# Altium project 20240807_MMIC_PCB_Carrier.PrjPcb
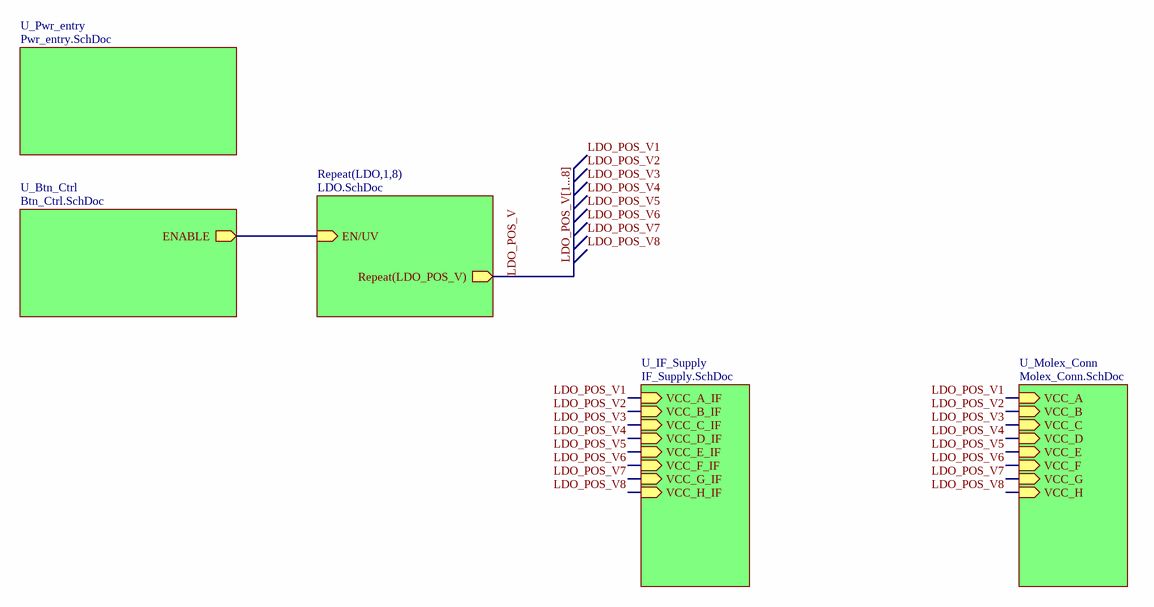
[diagram p0: MAIN_SCH.SchDoc]
6 sheets, 155 parts. Net scope: hierarchical (ports join the sheet entries above them; power ports are global).
Board file: 20240807_Carrier.PcbDoc
Sheets:
  MAIN_SCH.SchDoc
    LDO1 = LDO.SchDoc
    LDO2 = LDO.SchDoc
    LDO3 = LDO.SchDoc
    LDO4 = LDO.SchDoc
    LDO5 = LDO.SchDoc
    LDO6 = LDO.SchDoc
    LDO7 = LDO.SchDoc
    LDO8 = LDO.SchDoc
    U_Btn_Ctrl = Btn_Ctrl.SchDoc
    U_Pwr_entry = Pwr_entry.SchDoc
    U_IF_Supply = IF_Supply.SchDoc
    U_Molex_Conn = Molex_Conn.SchDoc

## Sheet MAIN_SCH.SchDoc
size A4; SheetNumber: 1; SheetTotal: 6

### Sub-sheets
Repeat(LDO,1,8) = LDO.SchDoc: EN/UV (in), Repeat(LDO_POS_V) (out)
U_Btn_Ctrl = Btn_Ctrl.SchDoc: ENABLE (out)
U_IF_Supply = IF_Supply.SchDoc: VCC_A_IF (in), VCC_B_IF (in), VCC_C_IF (in), VCC_D_IF (in), VCC_E_IF (in), VCC_F_IF (in), VCC_G_IF (in), VCC_H_IF (in)
U_Molex_Conn = Molex_Conn.SchDoc: VCC_A (in), VCC_B (in), VCC_C (in), VCC_D (in), VCC_E (in), VCC_F (in), VCC_G (in), VCC_H (in)
U_Pwr_entry = Pwr_entry.SchDoc: no entries

### Nets
LDO_POS_V: sheet Repeat(LDO,1,8)/Repeat(LDO_POS_V)
LDO_POS_V1: sheet U_IF_Supply/VCC_A_IF, sheet U_Molex_Conn/VCC_A  [project net J1-1]
LDO_POS_V2: sheet U_IF_Supply/VCC_B_IF, sheet U_Molex_Conn/VCC_B  [project net J1-3]
LDO_POS_V3: sheet U_IF_Supply/VCC_C_IF, sheet U_Molex_Conn/VCC_C  [project net J1-5]
LDO_POS_V4: sheet U_IF_Supply/VCC_D_IF, sheet U_Molex_Conn/VCC_D  [project net J1-7]
LDO_POS_V5: sheet U_IF_Supply/VCC_E_IF, sheet U_Molex_Conn/VCC_E  [project net J2-1]
LDO_POS_V6: sheet U_IF_Supply/VCC_F_IF, sheet U_Molex_Conn/VCC_F  [project net J2-3]
LDO_POS_V7: sheet U_IF_Supply/VCC_G_IF, sheet U_Molex_Conn/VCC_G  [project net J2-5]
LDO_POS_V8: sheet U_IF_Supply/VCC_H_IF, sheet U_Molex_Conn/VCC_H  [project net J2-7]
NetIC1_LDO1_4: sheet Repeat(LDO,1,8)/EN/UV, sheet U_Btn_Ctrl/ENABLE

### Buses and harness runs
bus LDO_POS_V[1...8]

### Notes on the sheet
- Labels drawn without touching a wire or pin: LDO_POS_V1, LDO_POS_V2, LDO_POS_V3, LDO_POS_V4, LDO_POS_V5, LDO_POS_V6, LDO_POS_V7, LDO_POS_V8
- Title
- Size:
- Date:
- A4
- Designer:
- Time:
- Sheet
- Revision:
- of
- University of Stuttgart
- ILH
- Pfaffenwaldring 47
- 70569 Stuttgart
- Germany
- File:

## Sheet LDO.SchDoc
size A4; SheetNumber: 3; SheetTotal: 6
Used 8 times, as channels LDO1, LDO2, LDO3, LDO4, LDO5, LDO6, LDO7, LDO8. Parts and nets are listed once, with the designators drawn on the sheet.
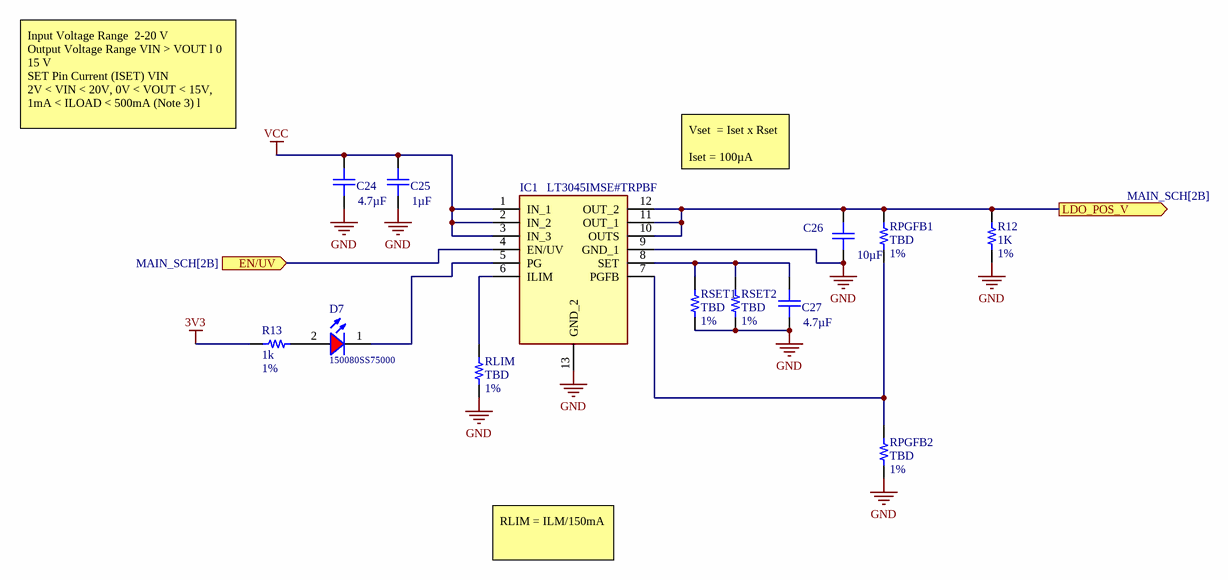
[diagram p1: LDO.SchDoc]

### Parts
C24  value 4.7µF  [FP-CL10-IPC_B]  (hidden comment: Capacitor)
C25  value 1µF  [FP-CL10-IPC_B]  (hidden comment: Capacitor)
C26  value 10µF  [FP-CL10-IPC_B]  (hidden comment: Capacitor)
C27  value 4.7µF  [FP-CL10-IPC_B]  (hidden comment: Capacitor)
D7  150080SS75000  [WL-SMCW_0805]
IC1  LT3045IMSE#TRPBF  [SOP65P490X110-13N]
R12  value 1K  Tolerance: 1%  [RESC1608X06N 0603 Medium Density]  (hidden comment: RC0603FR-071KL)
R13  value 1k  Tolerance: 1%  [RESC1608X06N 0603 Medium Density]  (hidden comment: RC0603FR-071KL)
RLIM  value TBD  Tolerance: 1%  [RESC1608X06N 0603 Medium Density]  (hidden comment: RC0603FR-071KL)
RPGFB1  value TBD  Tolerance: 1%  [RESC1608X06N 0603 Medium Density]  (hidden comment: RC0603FR-071KL)
RPGFB2  value TBD  Tolerance: 1%  [RESC1608X06N 0603 Medium Density]  (hidden comment: RC0603FR-071KL)
RSET1  value TBD  Tolerance: 1%  [RESC1608X06N 0603 Medium Density]  (hidden comment: RC0603FR-071KL)
RSET2  value TBD  Tolerance: 1%  [RESC1608X06N 0603 Medium Density]  (hidden comment: RC0603FR-071KL)

### Ports
EN/UV (in, see MAIN_SCH[2B]), LDO_POS_V (out, see MAIN_SCH[2B])

### Nets
3V3: R13.2
GND: C24.1 C25.1 C26.1 C27.1 IC1.9(GND_1) IC1.13(GND_2) R12.2 RLIM.2 RPGFB2.2 RSET1.2 RSET2.2
VCC: C24.2 C25.2 IC1.1(IN_1) IC1.2(IN_2) IC1.3(IN_3)
EN/UV: IC1.4(EN/UV) ; port EN/UV
LDO_POS_V: C26.2 IC1.10(OUTS) IC1.11(OUT_1) IC1.12(OUT_2) R12.1 RPGFB1.1 ; port LDO_POS_V
NetC27_2: C27.2 IC1.8(SET) RSET1.1 RSET2.1
NetD7_1: D7.1(K) IC1.5(PG)
NetD7_2: D7.2(A) R13.1
NetIC1_6: IC1.6(ILIM) RLIM.1
NetIC1_7: IC1.7(PGFB) RPGFB1.2 RPGFB2.1

### Channels
LDO1: designators end in _LDO1; ports EN/UV=NetIC1_LDO1_4 LDO_POS_V=J1-1
LDO2: designators end in _LDO2; ports EN/UV=NetIC1_LDO1_4 LDO_POS_V=J1-3
LDO3: designators end in _LDO3; ports EN/UV=NetIC1_LDO1_4 LDO_POS_V=J1-5
LDO4: designators end in _LDO4; ports EN/UV=NetIC1_LDO1_4 LDO_POS_V=J1-7
LDO5: designators end in _LDO5; ports EN/UV=NetIC1_LDO1_4 LDO_POS_V=J2-1
LDO6: designators end in _LDO6; ports EN/UV=NetIC1_LDO1_4 LDO_POS_V=J2-3
LDO7: designators end in _LDO7; ports EN/UV=NetIC1_LDO1_4 LDO_POS_V=J2-5
LDO8: designators end in _LDO8; ports EN/UV=NetIC1_LDO1_4 LDO_POS_V=J2-7

### Notes on the sheet
- Input Voltage Range  2-20 V
  Output Voltage Range VIN > VOUT l 0 15 V
  SET Pin Current (ISET) VIN
  2V < VIN < 20V, 0V < VOUT < 15V, 1mA < ILOAD < 500mA (Note 3) l
- Vset  = Iset x Rset
  Iset = 100µA
- RLIM = ILM/150mA
- Title
- Size:
- Date:
- A4
- Designer:
- Time:
- Sheet
- Revision:
- of
- University of Stuttgart
- ILH
- Pfaffenwaldring 47
- 70569 Stuttgart
- Germany
- File:

### Library data of the parts
C24-C27 = CMP-024-000000-16: SMT Capacitor; Design Item ID: Capacitor; Source: Passives.SchLib
D7 = CMP-027-000004-2: WL-SMCW SMT Mono-color Chip LED Waterclear, size 0805, Super Red, 1.9V, 140deg; Peak Wavelength typ.: 645nm; Chip Technology: AlInGaP; Dominant Wavelength typ.: 630nm; Luminous Intensity typ.: 60mcd; Operating Temperature: -40 to +85degC; Design Item ID: 150080SS75000; Size: 0805; Packaging: Tape and Reel; Emitting Color: Super Red; ComponentLink1URL: http://www.we-online.de; Part Number: 150080SS75000; Published Date: December 2019; ComponentLink2Description: Datasheet; ComponentLink2URL: https://www.we-online.com/catalog/datasheet/150080SS75000.pdf; Source: WL-SMCW_0805.SchLib; ComponentLink1Description: Manufacturer; Viewing Angle: 140deg; Forward Voltage typ.: 1.9V; Publisher: Wurth Elektronik; Mounting Technology: SMT
IC1 = LT3045IMSE#TRPBF: LDO Voltage Regulators 20V, 500mA, Ultralow Noise, Ultrahigh PSRR Linear Regulator; Manufacturer_Name: Analog Devices; Geometry.Height: 1.1mm; Mouser Part Number: 584-LT3045IMSE#TRPBF; Mouser Price/Stock: https://www.mouser.co.uk/ProductDetail/Analog-Devices/LT3045IMSETRPBF?qs=oahfZPh6IAI8jiLw9gdaFw%3D%3D; Manufacturer_Part_Number: LT3045IMSE#TRPBF; Datasheet Link: https://www.arrow.com/en/products/lt3045imsetrpbf/analog-devices
R12 R13 RLIM RPGFB1 RPGFB2 RSET1 RSET2 = CMP-009-00006-14: RES SMD 1K OHM 1% 1/10W 0603; Temperature Coefficient: 100ppm/°C; Power: 100mW; Voltage Rating: 75V; JLCPCB Part #: C21190; Min Operating Temperature: -55°C; RoHS Compliant: Yes; Height: 0.45mm; Max Operating Temperature: 155°C; Depth: 0.8mm; Pins: 2; Case/Package: 0603; Length: 1.6mm; Mounting Technology: Surface Mount

## Sheet Btn_Ctrl.SchDoc: Button control
size A4; SheetNumber: 2; SheetTotal: 6; Designer: Matthieu Menager
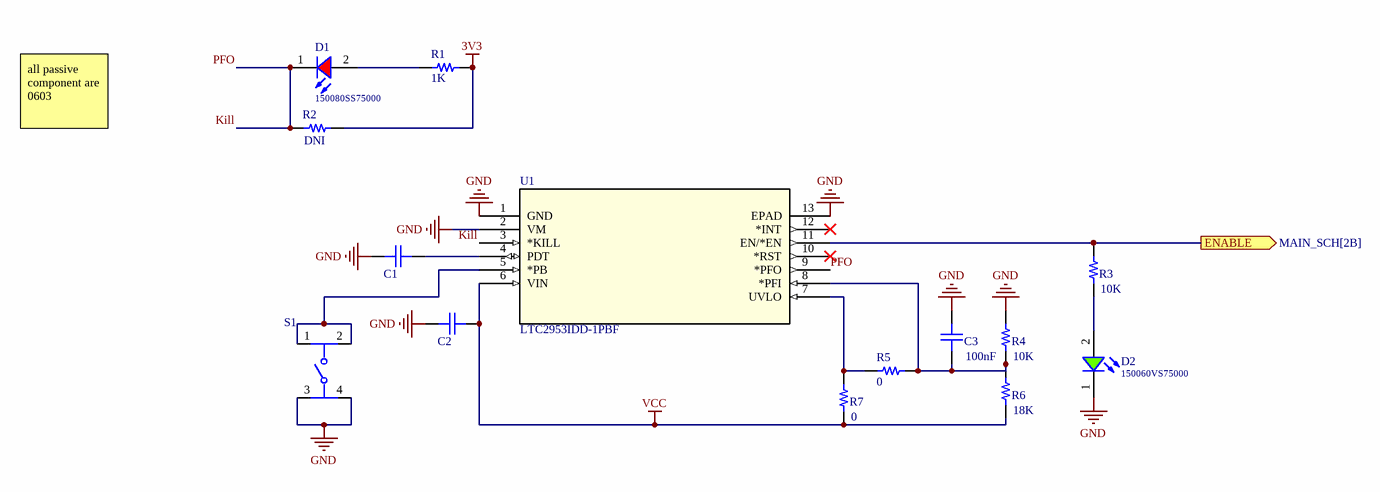
[diagram p2: Btn_Ctrl.SchDoc]

### Parts
C1  Capacitor  [FP-CL10-IPC_B]  (value not drawn)
C2  Capacitor  [FP-CL10-IPC_B]  (value not drawn)
C3  100nF  [FP-CL10-IPC_B]
D1  150080SS75000  [WL-SMCW_0805]
D2  150060VS75000  [WL-SMCW_0603_H=0.7mm]
R1  1K  [R_10k_JLC]
R2  DNI  [R_10k_JLC]
R3  10K  [R_10k_JLC]
R4  10K  [R_10k_JLC]
R5  0  [R_10k_JLC]
R6  18K  [R_10k_JLC]
R7  0  [R_10k_JLC]
S1  PTS645SH50SMTR92LFS  [FP-PTS645SM43SMTR92LFS-MFG]  (value not drawn)
U1  LTC2953IDD-1PBF  [DFN-12_DD_LIT]

### Ports
ENABLE (out, see MAIN_SCH[2B])

### Nets
3V3: R1.2 R2.2
GND: C1.1 C2.2 C3.2 D2.1(K) R4.2 S1.3 S1.4 U1.1(GND) U1.2(VM) U1.13(EPAD)
VCC: C2.1 R6.1 R7.1 U1.6(VIN)
Kill: D1.1(K) R2.1 U1.3(*KILL) U1.9(*PFO)  [also labelled PFO]
NetC1_2: C1.2 U1.4(PDT)
NetC3_1: C3.1 R4.1 R5.1 R6.2 U1.8(*PFI)
NetD1_2: D1.2(A) R1.1
NetD2_2: D2.2(A) R3.1
NetIC1_LDO1_4: R3.2 U1.11(EN/*EN) ; port ENABLE
NetR5_2: R5.2 R7.2 U1.7(UVLO)
NetS1_1: S1.1 S1.2 U1.5(*PB)

Not connected (* = marked no-connect by the designer): U1 10(*RST)* 12(*INT)*

### Notes on the sheet
- all passive component are 0603
- Title
- Size:
- Date:
- A4
- Designer:
- Time:
- Sheet
- Revision:
- of
- University of Stuttgart
- ILH
- Pfaffenwaldring 47
- 70569 Stuttgart
- Germany
- File:

### Library data of the parts
C1-C3 = CMP-024-000000-16: SMT Capacitor; Value: 0µF; Design Item ID: Capacitor; Source: Passives.SchLib
D1 = CMP-027-000004-2: as D7 on sheet LDO; Operating Temperature: -40 to +85degC; Design Item ID: 150080SS75000; Size: 0805; Packaging: Tape and Reel; Emitting Color: Super Red; ComponentLink1URL: http://www.we-online.de; Part Number: 150080SS75000; Published Date: December 2019; ComponentLink2Description: Datasheet; ComponentLink2URL: https://www.we-online.com/catalog/datasheet/150080SS75000.pdf; Source: WL-SMCW_0805.SchLib; ComponentLink1Description: Manufacturer; Viewing Angle: 140deg; Forward Voltage typ.: 1.9V; Publisher: Wurth Elektronik; Mounting Technology: SMT
D2 = CMP-029-000010-2: WL-SMCW SMT Mono-color Chip LED Waterclear, size 0603, Bright Green, 2V, 140deg; Luminous Intensity typ.: 40mcd; Chip Technology: AlInGaP; Dominant Wavelength typ.: 570nm; Peak Wavelength typ.: 572nm; ComponentLink2Description: Datasheet; Published Date: December 2019; Part Number: 150060VS75000; Source: WL-SMCW_0603.SchLib; Size: 0603; ComponentLink1Description: Manufacturer; Emitting Color: Bright Green; Packaging: Tape and Reel; Operating Temperature: -40 to +85degC; ComponentLink1URL: http://www.we-online.de; Publisher: Wurth Elektronik; Design Item ID: 150060VS75000; Forward Voltage typ.: 2V; ComponentLink2URL: https://www.we-online.com/catalog/datasheet/150060VS75000.pdf; Mounting Technology: SMT; Viewing Angle: 140deg
R1 R2 R5-R7 = CMP-009-00207-1: Fixed Resistor, Metal Glaze/thick Film, 0.1W, 10000ohm, 50V, 1% +/-Tol, 100ppm/Cel, Surface Mount, 0603; Value: 10k; Power: 100mW; Case/Package: 0603; Pins: 2; Min Operating Temperature: -55°C; JLCPCB Part #: C25804; Tolerance: 1%; Mounting Technology: Surface Mount; Max Operating Temperature: 155°C; RoHS Compliant: Yes
R3 R4 = CMP-009-00207-1: Fixed Resistor, Metal Glaze/thick Film, 0.1W, 10000ohm, 50V, 1% +/-Tol, 100ppm/Cel, Surface Mount, 0603; Power: 100mW; Case/Package: 0603; Pins: 2; Min Operating Temperature: -55°C; JLCPCB Part #: C25804; Value: 10k; Tolerance: 1%; Mounting Technology: Surface Mount; Max Operating Temperature: 155°C; RoHS Compliant: Yes
S1 = CMP-011-00001-2: Switch Tactile N.O. SPST Round Button Gull Wing 0.05A 12VDC 100000Cycles 1.96N SMD T/R
U1 = LTC2953IDD-1PBF: No Description Available; Mfr_Name: Analog Devices Inc; RefDes: RefDes; Type: Type

## Sheet Pwr_entry.SchDoc
size A4; Organization: Altium Limited; Address1: L3, 12a Rodborough Rd; Address2: Frenchs Forest; Address3: NSW; Address4: Australia 2086; SheetNumber: 4; SheetTotal: 6; SPICEModelCachePQHZHQPD: <root> / <DocumentId>PQHZHQPD</DocumentId> / <CacheFrame Number="0"> / <Model Name="1210_7447709470_47u" Kind="CKT"> / <Text>******* / .subckt 1210_7447709470_47u 1 2 / Rp 1 2 43179.7160489 / Cp 1 2 15.5579429534p / Rs 1 N3 0.0459 / L1 N3 2 38.0441176839u / .ends 1210_7447709470_47u</Text> / </Model> / </CacheFrame> / </root>
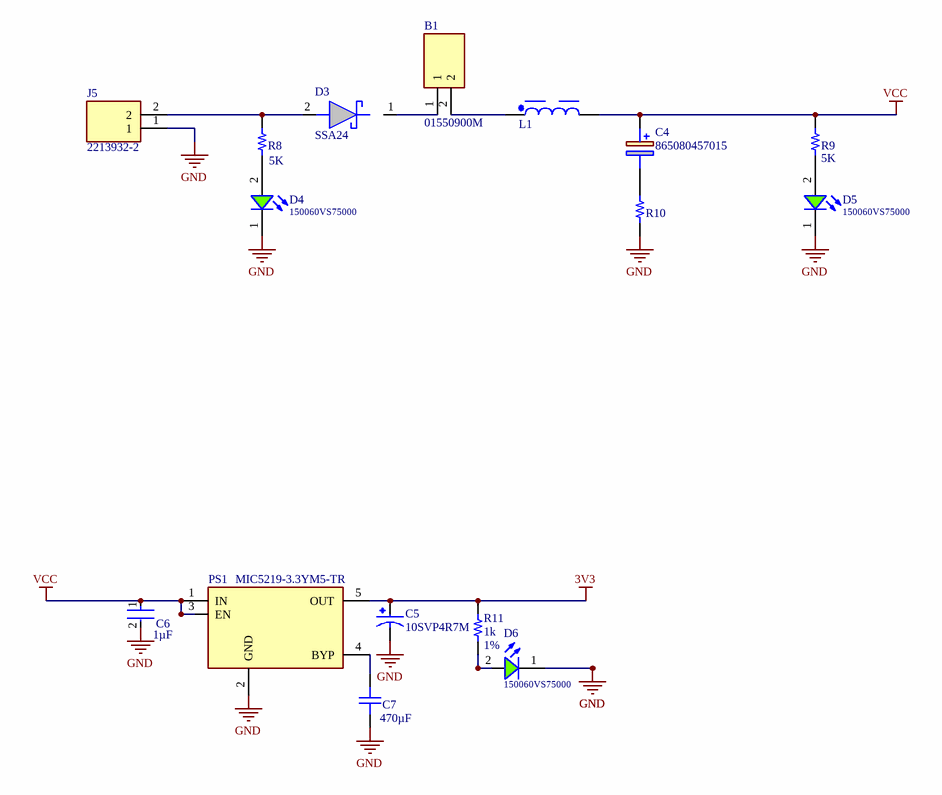
[diagram p3: Pwr_entry.SchDoc]

### Parts
B1  01550900M  [01550900M]
C4  865080457015  [CAPAE1030X1050L]
C5  10SVP4R7M  [CAP_10SVP4R7M]
C6  value 1µF  [FP-CL10-IPC_A]  (hidden comment: GCG188L8EE105KA07D)
C7  value 470µF  [FP-CL10-IPC_B]  (hidden comment: Capacitor)
D3  SSA24  [DIOM5227X250N]
D4  150060VS75000  [WL-SMCW_0603_H=0.7mm]
D5  150060VS75000  [WL-SMCW_0603_H=0.7mm]
D6  150060VS75000  [WL-SMCW_0603_H=0.7mm]
J5  2213932-2  [22139322]
L1  47uH, 3.8A  [WE-PD_1210]  (value not drawn)
PS1  MIC5219-3.3YM5-TR  [SOT95P280X145-5N]
R8  5K  [FP-CR0603-IPC_A]
R9  value 5K  [FP-CR0603-IPC_A]  (hidden comment: CR0603-JW-101ELF)
R10  CRCW08050000Z0EA  [RESC2013X50X30ML20T20]  (value not drawn)
R11  value 1k  Tolerance: 1%  [RESC1608X06N 0603 Medium Density]  (hidden comment: RC0603FR-071KL)

### Nets
3V3: C5.1 PS1.5(OUT) R11.2
GND: C5.2 C6.2 C7.1 D4.1(K) D5.1(K) D6.1(K) J5.1 PS1.2(GND) R10.1
VCC: C4.1(+) C6.1 L1.2 PS1.1(IN) PS1.3(EN) R9.2
NetB1_1: B1.1 D3.1(K)
NetB1_2: B1.2 L1.1
NetC4_2: C4.2(-) R10.2
NetC7_2: C7.2 PS1.4(BYP)
NetD3_2: D3.2(A) J5.2 R8.2
NetD4_2: D4.2(A) R8.1
NetD5_2: D5.2(A) R9.1
NetD6_2: D6.2(A) R11.1

### Notes on the sheet
- Title
- Size:
- Date:
- A4
- Designer:
- Time:
- Sheet
- Revision:
- of
- University of Stuttgart
- ILH
- Pfaffenwaldring 47
- 70569 Stuttgart
- Germany
- File:

### Library data of the parts
B1 = 01550900M: Fuse Block 10 A 125V 1 Circuit Cartridge Surface Mount; Manufacturer_Name: LITTELFUSE; Geometry.Height: 3.81mm; Mouser Part Number: 576-01550900M; Mouser Price/Stock: https://www.mouser.co.uk/ProductDetail/Littelfuse/01550900M?qs=DDoybve0rC%252BTXq1hqi5X1g%3D%3D; Manufacturer_Part_Number: 01550900M; Datasheet Link: http://www.littelfuse.com/~/media/electronics/datasheets/fuses/littelfuse_fuse_154_154t_154l_154tl_datasheet.pdf.pdf
C4 = 865080457015: Wurth Elektronik 470uF 25 V dc Aluminium Electrolytic Capacitor, WCAP-ASLI Series 2000h 10 (Dia.) x 10.35mm; Geometry.Height: 10.5mm; Mouser Part Number: 710-865080457015; Mouser Price/Stock: https://www.mouser.co.uk/ProductDetail/Wurth-Elektronik/865080457015?qs=0KOYDY2FL2%252BEKTJa1jxjAQ%3D%3D; Manufacturer_Name: Wurth Elektronik; Manufacturer_Part_Number: 865080457015; Datasheet Link: https://www.we-online.com/catalog/datasheet/865080457015_valid_from_2022-04-21.pdf
C6 = CMP-001-00050-1: Ceramic Capacitor, Multilayer, Ceramic, 16V, 10% +Tol, 10% -Tol, X8L, -40/+15% TC, 1uF, Surface Mount, 0603; Multilayer: Yes; Reference Standard: AEC-Q200; Mounting Technology: Surface Mount; Termination: Wraparound; Capacitor Type: Ceramic; Case/Package: 0603; Packaging: Tape and Reel; Max Operating Temperature: 150°C; Package Shape: Rectangular; Min Operating Temperature: -55°C; RoHS Compliant: Yes; Dielectric Material: Ceramic; Pins: 2; Temperature Characteristics Code: X8L; Tolerance  (fill in as +-): 10%; Rated DC Voltage (URdc): 16V; Tolerance (fill in as +-): 10%; Reach SVHC Compliant: Yes
C7 = CMP-024-000000-16: SMT Capacitor; Design Item ID: Capacitor; Source: Passives.SchLib
D3 = SSA24: Schottky Diodes & Rectifiers 2A, 40V SMA SCHOTTKY; Manufacturer_Name: onsemi; Geometry.Height: 2.5mm; Farnell Part Number: *; Farnell Price/Stock: *; Manufacturer_Part_Number: SSA24; Datasheet Link: https://www.onsemi.com/download/data-sheet/pdf/ssa24-d.pdf
D4-D6 = CMP-029-000010-2: as D2 on sheet Btn_Ctrl; ComponentLink2Description: Datasheet; Published Date: December 2019; Part Number: 150060VS75000; Source: WL-SMCW_0603.SchLib; Size: 0603; ComponentLink1Description: Manufacturer; Emitting Color: Bright Green; Packaging: Tape and Reel; Operating Temperature: -40 to +85degC; ComponentLink1URL: http://www.we-online.de; Publisher: Wurth Elektronik; Design Item ID: 150060VS75000; Forward Voltage typ.: 2V; ComponentLink2URL: https://www.we-online.com/catalog/datasheet/150060VS75000.pdf; Mounting Technology: SMT; Viewing Angle: 140deg
J5 = 2213932-2: Body Features: Product Orientation Right Angle; Manufacturer_Name: TE Connectivity; Geometry.Height: 7mm; Mouser Part Number: 571-2213932-2; Mouser Price/Stock: https://www.mouser.co.uk/ProductDetail/TE-Connectivity-Buchanan/2213932-2?qs=BZBei1rCqCB1cq5VfQayMg%3D%3D; Manufacturer_Part_Number: 2213932-2; Datasheet Link: https://www.te.com/commerce/DocumentDelivery/DDEController?Action=srchrtrv&DocNm=1-1773930-3_BuchananWM_Brochure&DocType=Data%20Sheet&DocLang=English&PartCntxt=2213932-2&DocFormat=pdf
L1 = 7447709470: WE-PD SMT Power Inductor, size 1210, 47uH, 3.8A, 60mOhm; Manufacturer: Wurth Elektronik; Case/Size Code: 1210; DC Resistance: 46mOhm; Saturation Current: 4.5A; Self Resonant Frequency: 6.5MHz; Type: Standard; Manufacturer Part Number: 7447709470; Category: Power Inductors; Match Code: WE-PD; ComponentLink1Description: Website Link; ComponentLink1URL: https://www.we-online.com/redexpert/article/7447709470?ad; ComponentLink2Description: Datasheet Link; ComponentLink2URL: https://www.we-online.com/redexpert/spec/7447709470?ad; Mount: Surface Mount; Operating Temperature Max: 125°C; Operating Temperature Min: -40°C; Packaging: Tape and Reel; Length: 12mm; Width: 12mm; Height: 10mm; DC Resistance Max: 60mOhm; Inductance: 47uH; Rated Current: 3.8A
PS1 = MIC5219-3.3YM5-TR: LDO Regulator Pos 3.3V 0.5A Microchip MIC5219-3.3YM5-TR, LDO Voltage Regulator, 500mA, 3.3 V +/-2%, 2.5  12 Vin, 5-Pin SOT-23; Geometry.Height: 1.45mm; Mouser Part Number: 998-MIC5219-3.3YM5TR; Mouser Price/Stock: https://www.mouser.co.uk/ProductDetail/Microchip-Technology/MIC5219-3.3YM5-TR?qs=U6T8BxXiZAWojkIJMtSJlw%3D%3D; Manufacturer_Name: Microchip; Manufacturer_Part_Number: MIC5219-3.3YM5-TR; Datasheet Link: http://www.microchip.com/mymicrochip/filehandler.aspx?ddocname=en579712
R8 = CMP-009-00203-1: Fixed Resistor, Metal Glaze/thick Film, 0.1W, 100ohm, 75V, 5% +/-Tol, 200ppm/Cel, Surface Mount, 0603 CR0603-JW-101ELF; Power: 100mW; Tolerance: 5%; Min Operating Temperature: -55°C; Value: 5K; Max Operating Temperature: 155°C; Pins: 2; JLCPCB Part #: C913237; RoHS Compliant: Yes; Mounting Technology: Surface Mount; Case/Package: 0603
R9 = CMP-009-00203-1: Fixed Resistor, Metal Glaze/thick Film, 0.1W, 100ohm, 75V, 5% +/-Tol, 200ppm/Cel, Surface Mount, 0603; Power: 100mW; Tolerance: 5%; Min Operating Temperature: -55°C; Max Operating Temperature: 155°C; Pins: 2; JLCPCB Part #: C913237; RoHS Compliant: Yes; Mounting Technology: Surface Mount; Case/Package: 0603
R10 = CMP-009-00140-3: Fixed Resistor, Metal Glaze/thick Film, 0.125W, 0ohm, Surface Mount, 0805; Reference Standard: AEC-Q200; Package Length: 2mm; Power: 125mW; Package Width: 1.25mm; Rated Temperature: 70°C; Package Height: 0.45mm; Value: 0; Mounting Technology: Surface Mount; Resistor Type: FIXED RESISTOR; Packaging: Tape and Reel; Technology: METAL GLAZE/THICK FILM; RoHS Compliant: Yes; JESD-609 Code: e3; Min Operating Temperature: -55°C; Case/Package: 0805; Construction: Chip; Max Operating Temperature: 155°C; Terminal Finish: Nickel; Termination: Wraparound; Package Shape: Rectangular; Pins: 2; Reach SVHC Compliant: Yes; Package Style: SMTMeter
R11 = CMP-009-00006-14: as R12 on sheet LDO; JLCPCB Part #: C21190; Min Operating Temperature: -55°C; RoHS Compliant: Yes; Height: 0.45mm; Max Operating Temperature: 155°C; Depth: 0.8mm; Pins: 2; Case/Package: 0603; Length: 1.6mm; Mounting Technology: Surface Mount
C5 = 10SVP4R7M: MP: 10SVP4R7M; Availability: Unavailable; Package: None; Value: *; Price: None

## Sheet IF_Supply.SchDoc
size A4; SheetNumber: 5; SheetTotal: 6
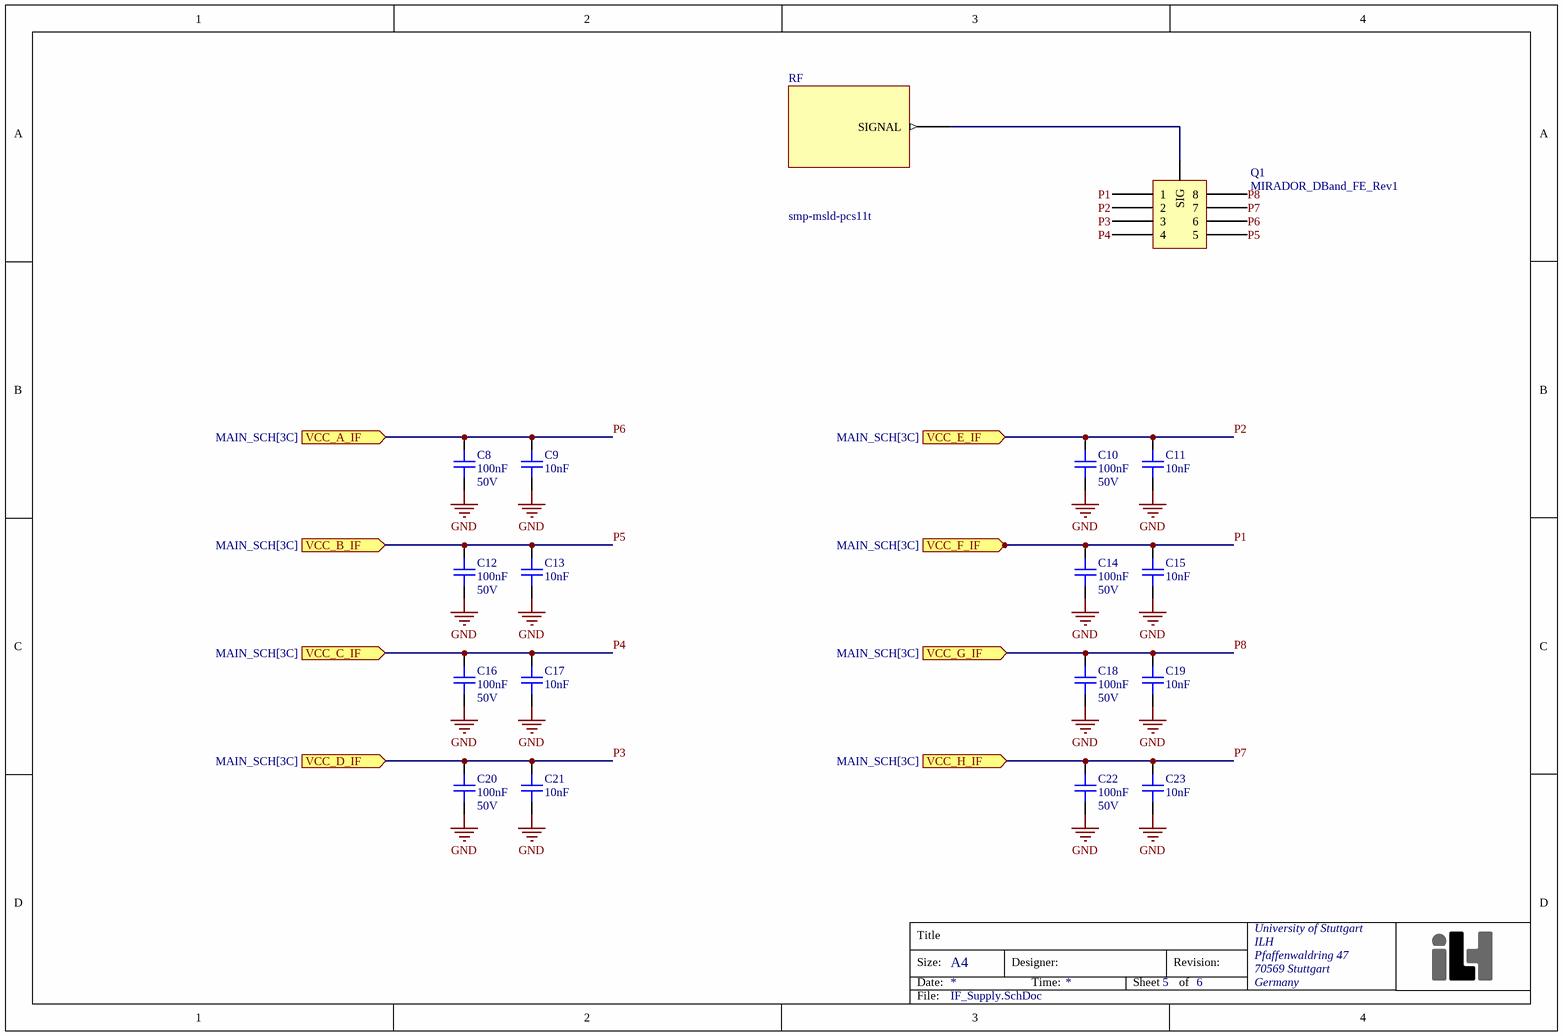
[diagram p4: IF_Supply.SchDoc]

### Parts
C8  value 100nF  Voltage Rating: 50V  [CAPC1608X90X35LL15T15]  (hidden comment: 06035C104KAT4A)
C9  value 10nF  [CAPC1050X55X23ML05T13]  (hidden comment: CL05B104KO5NNNC)
C10  value 100nF  Voltage Rating: 50V  [CAPC1608X90X35LL15T15]  (hidden comment: 06035C104KAT4A)
C11  value 10nF  [CAPC1050X55X23ML05T13]  (hidden comment: CL05B104KO5NNNC)
C12  value 100nF  Voltage Rating: 50V  [CAPC1608X90X35LL15T15]  (hidden comment: 06035C104KAT4A)
C13  value 10nF  [CAPC1050X55X23ML05T13]  (hidden comment: CL05B104KO5NNNC)
C14  value 100nF  Voltage Rating: 50V  [CAPC1608X90X35LL15T15]  (hidden comment: 06035C104KAT4A)
C15  value 10nF  [CAPC1050X55X23ML05T13]  (hidden comment: CL05B104KO5NNNC)
C16  value 100nF  Voltage Rating: 50V  [CAPC1608X90X35LL15T15]  (hidden comment: 06035C104KAT4A)
C17  value 10nF  [CAPC1050X55X23ML05T13]  (hidden comment: CL05B104KO5NNNC)
C18  value 100nF  Voltage Rating: 50V  [CAPC1608X90X35LL15T15]  (hidden comment: 06035C104KAT4A)
C19  value 10nF  [CAPC1050X55X23ML05T13]  (hidden comment: CL05B104KO5NNNC)
C20  value 100nF  Voltage Rating: 50V  [CAPC1608X90X35LL15T15]  (hidden comment: 06035C104KAT4A)
C21  value 10nF  [CAPC1050X55X23ML05T13]  (hidden comment: CL05B104KO5NNNC)
C22  value 100nF  Voltage Rating: 50V  [CAPC1608X90X35LL15T15]  (hidden comment: 06035C104KAT4A)
C23  value 10nF  [CAPC1050X55X23ML05T13]  (hidden comment: CL05B104KO5NNNC)
Q1  MIRADOR_DBand_FE_Rev1  [MMIC_SMM-Footprint-1]
RF  smp-msld-pcs11t  [SMP_FTP]

### Ports
VCC_A_IF (in, see MAIN_SCH[3C]), VCC_B_IF (in, see MAIN_SCH[3C]), VCC_C_IF (in, see MAIN_SCH[3C]), VCC_D_IF (in, see MAIN_SCH[3C]), VCC_E_IF (in, see MAIN_SCH[3C]), VCC_F_IF (in, see MAIN_SCH[3C]), VCC_G_IF (in, see MAIN_SCH[3C]), VCC_H_IF (in, see MAIN_SCH[3C])

### Nets
GND: C8.1 C9.1 C10.1 C11.1 C12.1 C13.1 C14.1 C15.1 C16.1 C17.1 C18.1 C19.1 C20.1 C21.1 C22.1 C23.1
P1: C14.2 C15.2 Q1.1 ; port VCC_F_IF  [project net J2-3]
P2: C10.2 C11.2 Q1.2 ; port VCC_E_IF  [project net J2-1]
P3: C20.2 C21.2 Q1.3 ; port VCC_D_IF  [project net J1-7]
P4: C16.2 C17.2 Q1.4 ; port VCC_C_IF  [project net J1-5]
P5: C12.2 C13.2 Q1.5 ; port VCC_B_IF  [project net J1-3]
P6: C8.2 C9.2 Q1.6 ; port VCC_A_IF  [project net J1-1]
P7: C22.2 C23.2 Q1.7 ; port VCC_H_IF  [project net J2-7]
P8: C18.2 C19.2 Q1.8 ; port VCC_G_IF  [project net J2-5]
NetQ1_SIG: Q1.SIG RF.2(SIGNAL)

### Notes on the sheet
- Title
- Size:
- Date:
- A4
- Designer:
- Time:
- Sheet
- Revision:
- of
- University of Stuttgart
- ILH
- Pfaffenwaldring 47
- 70569 Stuttgart
- Germany
- File:

### Library data of the parts
C8 C10 C12 C14 C16 C18 C20 C22 = CMP-001-00048-2: Ceramic Capacitor, Multilayer, Ceramic, 50V, 10% +Tol, 10% -Tol, X7R, 15% TC, 0.1uF, Surface Mount, 0603; Multilayer: Yes; Capacitance: 100 nF; Temperature Characteristics Code: X7R; Length: 1.6mm; Height: 0.9mm; Packaging: Tape and Reel; Tolerance: 10%; Mounting Technology: Surface Mount; Rated DC Voltage (URdc): 50V; Package Style: SMTMeter; Tolerance (fill in as +-): 10%; RoHS Compliant: Yes; Min Operating Temperature: -55°C; Capacitor Type: Ceramic; JESD-609 Code: e3; Terminal Finish: Nickel; Max Operating Temperature: 125°C; Pins: 2; Tolerance  (fill in as +-): 10%; Width: 0.81mm; Termination: Wraparound; Reach SVHC Compliant: Yes; Dielectric Material: Ceramic; Package Shape: Rectangular; Case/Package: 0603
C9 C11 C13 C15 C17 C19 C21 C23 = CMP-001-00053-1: Ceramic Capacitor, Multilayer, Ceramic, 16V, 10% +Tol, 10% -Tol, X7R, 15% TC, 0.1uF, Surface Mount, 0402; Multilayer: Yes; Case/Package: 0402; Tolerance (fill in as +-): 10%; Length: 1mm; Reach SVHC Compliant: Yes; Packaging: Tape and Reel; Package Shape: Rectangular; Width: 0.5mm; Mounting Technology: Surface Mount; Terminal Finish: Nickel; Max Operating Temperature: 125°C; Dielectric Material: Ceramic; Package Style: SMTMeter; Rated DC Voltage (URdc): 16V; Temperature Characteristics Code: X7R; Capacitor Type: Ceramic; JESD-609 Code: e3; Height: 0.55mm; Min Operating Temperature: -55°C; Termination: Wraparound; RoHS Compliant: Yes; Pins: 2; Tolerance  (fill in as +-): 10%
Q1 = MMIC_SMM_01-10: DC and IF bonded footprint of TWA+self-mixing mixer
RF = CMP-00053-13: RF Connector SMP Straight PCB Limited Detent Jack Surface Mount 50 Ohm footprint is made for Dk : 4.2 and height 800µm; Gender: m; Connector Type: smp; Mounting Technology: smd

## Sheet Molex_Conn.SchDoc
size A4; SheetNumber: 6; SheetTotal: 6
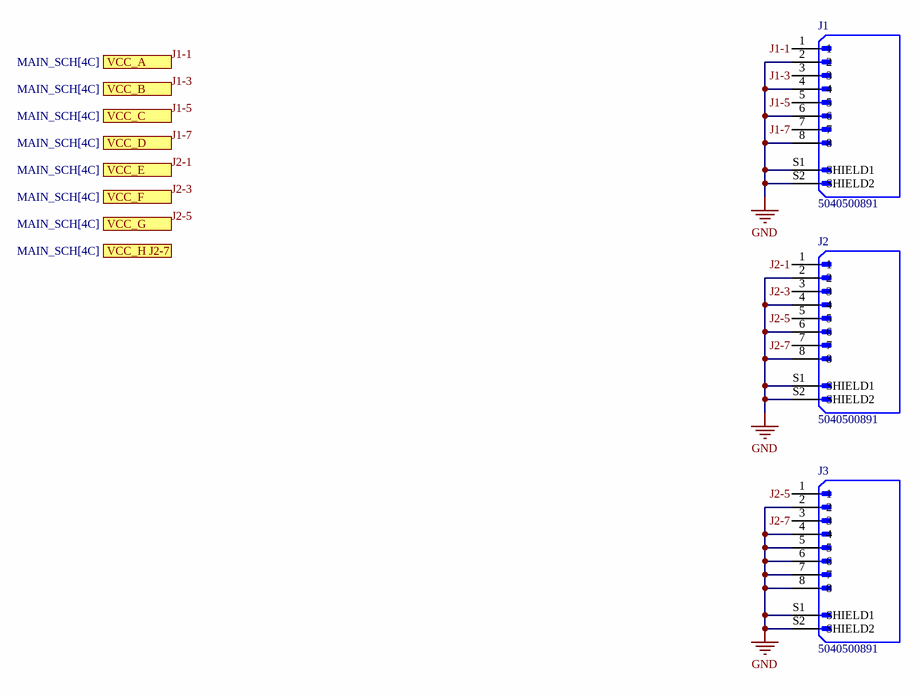
[diagram p5: Molex_Conn.SchDoc]

### Parts
J1  5040500891  [MOLEX_5040500891]
J2  5040500891  [MOLEX_5040500891]
J3  5040500891  [MOLEX_5040500891]

### Ports
VCC_A (in, see MAIN_SCH[4C]), VCC_B (in, see MAIN_SCH[4C]), VCC_C (in, see MAIN_SCH[4C]), VCC_D (in, see MAIN_SCH[4C]), VCC_E (in, see MAIN_SCH[4C]), VCC_F (in, see MAIN_SCH[4C]), VCC_G (in, see MAIN_SCH[4C]), VCC_H (in, see MAIN_SCH[4C])

### Nets
GND: J1.2 J1.4 J1.6 J1.8 J1.S1(SHIELD1) J1.S2(SHIELD2) J2.2 J2.4 J2.6 J2.8 J2.S1(SHIELD1) J2.S2(SHIELD2) J3.2 J3.4 J3.5 J3.6 J3.7 J3.8 J3.S1(SHIELD1) J3.S2(SHIELD2)
J1-1: J1.1 ; port VCC_A
J1-3: J1.3 ; port VCC_B
J1-5: J1.5 ; port VCC_C
J1-7: J1.7 ; port VCC_D
J2-1: J2.1 ; port VCC_E
J2-3: J2.3 ; port VCC_F
J2-5: J2.5 J3.1 ; port VCC_G
J2-7: J2.7 J3.3 ; port VCC_H

### Notes on the sheet
- Title
- Size:
- Date:
- A4
- Designer:
- Time:
- Sheet
- Revision:
- of
- University of Stuttgart
- ILH
- Pfaffenwaldring 47
- 70569 Stuttgart
- Germany
- File:

### Library data of the parts
J1-J3 = 5040500891: Value: *; Availability: Unavailable; Price: None; MP: 5040500891; Package: None

## Nets that join several sheets
3V3: LDO1 (R13_LDO1.2), LDO2 (R13_LDO2.2), LDO3 (R13_LDO3.2), LDO4 (R13_LDO4.2), LDO5 (R13_LDO5.2), LDO6 (R13_LDO6.2), LDO7 (R13_LDO7.2), LDO8 (R13_LDO8.2), Btn_Ctrl (R1.2 R2.2), Pwr_entry (C5.1 PS1.5 R11.2)
GND: LDO1 (11 pins), LDO2 (11 pins), LDO3 (11 pins), LDO4 (11 pins), LDO5 (11 pins), LDO6 (11 pins), LDO7 (11 pins), LDO8 (11 pins), Btn_Ctrl (10 pins), Pwr_entry (9 pins), IF_Supply (16 pins), Molex_Conn (20 pins)
VCC: LDO1 (5 pins), LDO2 (5 pins), LDO3 (5 pins), LDO4 (5 pins), LDO5 (5 pins), LDO6 (5 pins), LDO7 (5 pins), LDO8 (5 pins), Btn_Ctrl (C2.1 R6.1 R7.1 U1.6), Pwr_entry (6 pins)
J1-1: LDO1 (6 pins), IF_Supply (C8.2 C9.2 Q1.6), Molex_Conn (J1.1)
J1-3: LDO2 (6 pins), IF_Supply (C12.2 C13.2 Q1.5), Molex_Conn (J1.3)
J1-5: LDO3 (6 pins), IF_Supply (C16.2 C17.2 Q1.4), Molex_Conn (J1.5)
J1-7: LDO4 (6 pins), IF_Supply (C20.2 C21.2 Q1.3), Molex_Conn (J1.7)
J2-1: LDO5 (6 pins), IF_Supply (C10.2 C11.2 Q1.2), Molex_Conn (J2.1)
J2-3: LDO6 (6 pins), IF_Supply (C14.2 C15.2 Q1.1), Molex_Conn (J2.3)
J2-5: LDO7 (6 pins), IF_Supply (C18.2 C19.2 Q1.8), Molex_Conn (J2.5 J3.1)
J2-7: LDO8 (6 pins), IF_Supply (C22.2 C23.2 Q1.7), Molex_Conn (J2.7 J3.3)
NetIC1_LDO1_4: LDO1 (IC1_LDO1.4), LDO2 (IC1_LDO2.4), LDO3 (IC1_LDO3.4), LDO4 (IC1_LDO4.4), LDO5 (IC1_LDO5.4), LDO6 (IC1_LDO6.4), LDO7 (IC1_LDO7.4), LDO8 (IC1_LDO8.4), Btn_Ctrl (R3.2 U1.11)

## Assembly variants
MMIC_PCB_Carrier comp value: all parts fitted